# EAGLE design main_board (EAGLE 7.2.0)
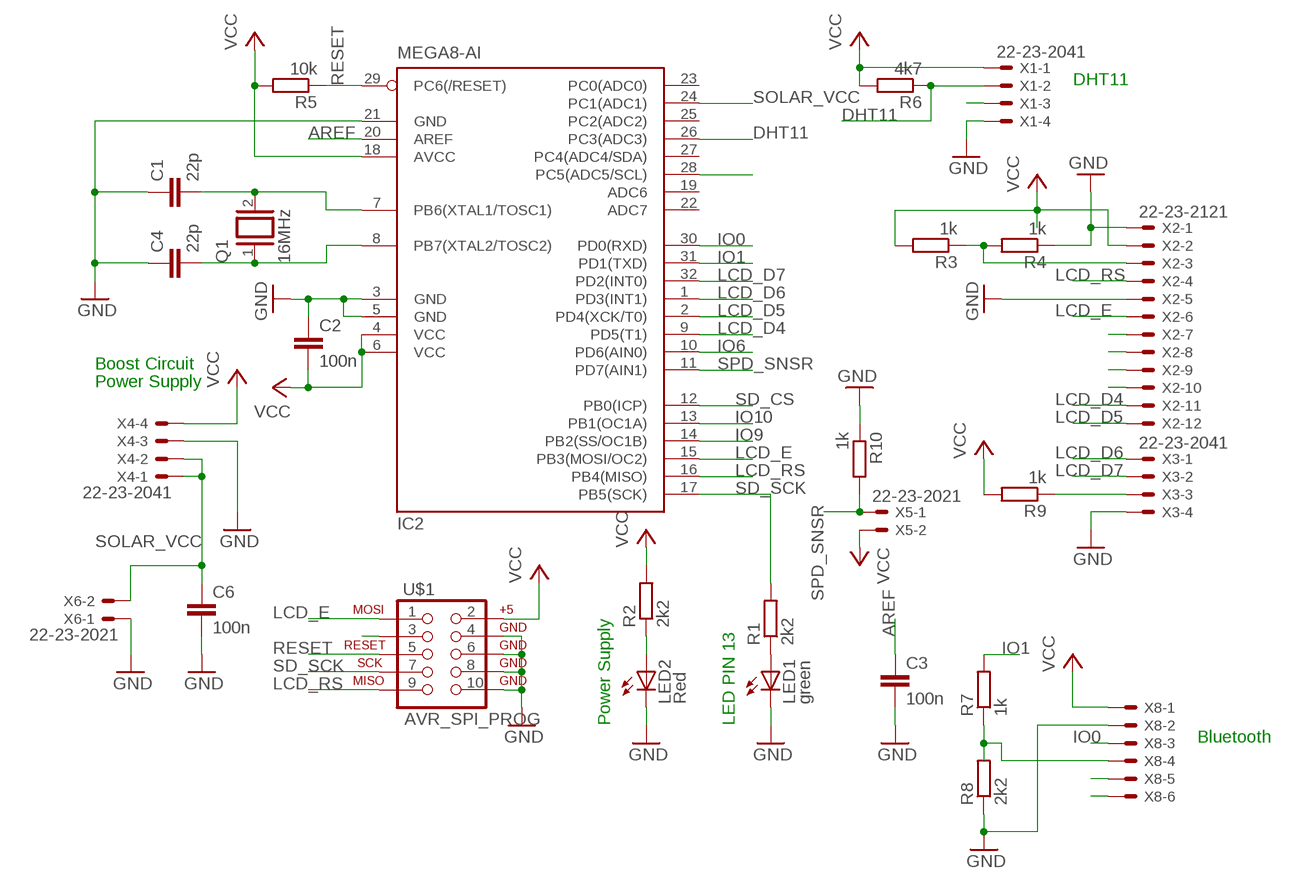
[diagram p0: schematic, sheet 1]

## Parts
C1  22p  C2,5-3  [C2.5-3]
C2  100n  C5/3  [C5B3]
C3  100n  C5/3  [C5B3]
C4  22p  C2,5-3  [C2.5-3]
C6  100n  C7.5/6  [C7.5B6]
IC2  MEGA8-AI  [TQFP32-08]
LED1  green  LED3MM  [LED3MM]
LED2  Red  LED3MM  [LED3MM]
Q1  16MHz  XTAL/S  [QS]
R1  2k2  R-EU_0204/2V  [0204V]
R2  2k2  R-EU_0204/2V  [0204V]
R3  1k  R-EU_0204/2V  [0204V]
R4  1k  R-EU_0204/2V  [0204V]
R5  10k  R-EU_0204/2V  [0204V]
R6  4k7  R-EU_0204/2V  [0204V]
R7  1k  R-EU_0204/2V  [0204V]
R8  2k2  R-EU_0204/2V  [0204V]
R9  1k  R-EU_0204/2V  [0204V]
R10  1k  R-EU_0204/2V  [0204V]
U$1  AVR_SPI_PROG  [AVR_ICSP]
X1  22-23-2041  [22-23-2041]
X2  22-23-2121  [22-23-2121]
X3  22-23-2041  [22-23-2041]
X4  22-23-2041  [22-23-2041]
X5  22-23-2021  [22-23-2021]
X6  22-23-2021  [22-23-2021]
X8  22-23-2061  [22-23-2061]

## Nets
AREF: C3.1 IC2.20(AREF)
BMP180_SCL: IC2.28(PC5(ADC5/SCL))
DHT11: IC2.26(PC3(ADC3)) R6.1 X1.2
GND: C1.1 C2.1 C3.2 C4.1 C6.2 IC2.3(GND) IC2.5(GND) IC2.21(GND) LED1.K(C) LED2.K(C) R4.1 R8.1 R10.1 U$1.4 U$1.6 U$1.8 U$1.10 X1.4 X2.1 X2.5 X3.4 X4.3 X6.1 X8.2
IO0: IC2.30(PD0(RXD)) X8.3
IO1: IC2.31(PD1(TXD)) R7.2
IO6: IC2.10(PD6(AIN0))
IO9: IC2.14(PB2(SS/OC1B))
IO10: IC2.13(PB1(OC1A))
LCD_D4: IC2.9(PD5(T1)) X2.11
LCD_D5: IC2.2(PD4(XCK/T0)) X2.12
LCD_D6: IC2.1(PD3(INT1)) X3.1
LCD_D7: IC2.32(PD2(INT0)) X3.2
LCD_E: IC2.15(PB3(MOSI/OC2)) U$1.1 X2.6
LCD_RS: IC2.16(PB4(MISO)) U$1.9 X2.4
N$1: X1.3
N$2: C1.2 IC2.7(PB6(XTAL1/TOSC1)) Q1.2
N$3: C4.2 IC2.8(PB7(XTAL2/TOSC2)) Q1.1
N$4: LED1.A R1.1
N$5: U$1.3
N$6: LED2.A R2.1
N$7: R9.1 X3.3
N$8: R3.1 R4.2 X2.3
N$9: X2.7
N$10: R7.1 R8.2 X8.4
N$11: X8.5
N$12: X8.6
N$13: X2.8
N$14: X2.9
N$15: X2.10
RESET: IC2.29(PC6(/RESET)) R5.1 U$1.5
SD_CS: IC2.12(PB0(ICP))
SD_SCK: IC2.17(PB5(SCK)) R1.2 U$1.7
SOLAR_VCC: C6.1 IC2.24(PC1(ADC1)) X4.1 X4.2 X6.2
SPD_SNSR: IC2.11(PD7(AIN1)) R10.2 X5.1
VCC: C2.2 IC2.4(VCC) IC2.6(VCC) IC2.18(AVCC) R2.2 R3.2 R5.2 R6.2 R9.2 U$1.2 X1.1 X2.2 X4.4 X5.2 X8.1
Unconnected: IC2.19(ADC6) IC2.22(ADC7) IC2.23(PC0(ADC0)) IC2.25(PC2(ADC2)) IC2.27(PC4(ADC4/SDA))

## Notes on the sheet
- DHT11
- Boost Circuit
- Power Supply
- Power Supply | LED PIN 13
- Bluetooth

## Library data of the parts
C1-C4 C6 = capacitor-wima:C: CAPACITOR naming: grid - package width
IC2 = atmel:MEGA8: MICROCONTROLLER 8 Kbytes FLASH, 1 kbytes SRAM, 512 bytes EEPROM, USART, 6-channel 10 bit ADC, 2-channel 8 bit ADC Pin compatible with Atmega48, ATMega88, ATMega168 Source: avr.lbr; MPN: ATMEGA8-16AU; OC_FARNELL: 9171371; OC_NEWARK: 73M8863
LED1 LED2 = led:LED: LED OSRAM: - CHIPLED LG R971, LG N971, LY N971, LG Q971, LY Q971, LO R971, LY R971 LH N974, LH R974 LS Q976, LO Q976, LY Q976 LO Q996 - Hyper CHIPLED LW Q18S LB Q993, LB Q99A, LB R99A - SideLED LS A670, LO A670, LY A670, LG A670, LP A670 LB A673, LV A673, LT A673, LW A673 LH A674 LY A675 LS A676, LA A676, LO A676, LY A676, LW A676 LS A679, LY A679, LG A679 - Hyper Micro SIDELED® LS Y876, LA Y876, LO Y876, LY Y876 LT Y87S - SmartLED LW L88C, LW L88S LB L89C, LB L89S, LG L890 LS L89K, LO L89K, LY L89K LS L896, LA L896, LO L896, LY L896 - TOPLED LS T670, LO T670, LY T670, LG T670, LP T670 LSG T670, LSP T670, LSY T670, LOP T670, LYG T670 LG T671, LOG T671, LSG T671 LB T673, LV T673, LT T673, LW T673 LH T674 LS T676, LA T676, LO T676, LY T676, LB T676, LH T676, LSB T676, LW T676 LB T67C, LV T67C, LT T67C, LS T67K, LO T67K, LY T67K, LW E67C LS E67B, LA E67B, LO E67B, LY E67B, LB E67C, LV E67C, LT E67C LW T67C LS T679, LY T679, LG T679 LS T770, LO T770, LY T770, LG T770, LP T770 LB T773, LV T773, LT T773, LW T773 LH T774 LS E675, LA E675, LY E675, LS T675 LS T776, LA T776, LO T776, LY T776, LB T776 LHGB T686 LT T68C, LB T68C - Hyper Mini TOPLED® LB M676 - Mini TOPLED Santana® LG M470 LS M47K, LO M47K, LY M47K Source: http://www.osram.convergy.de LUXEON: - LUMILED® LXK2-PW12-R00, LXK2-PW12-S00, LXK2-PW14-U00, LXK2-PW14-V00 LXK2-PM12-R00, LXK2-PM12-S00, LXK2-PM14-U00 LXK2-PE12-Q00, LXK2-PE12-R00, LXK2-PE12-S00, LXK2-PE14-T00, LXK2-PE14-U00 LXK2-PB12-K00, LXK2-PB12-L00, LXK2-PB12-M00, LXK2-PB14-N00, LXK2-PB14-P00, LXK2-PB14-Q00 LXK2-PR12-L00, LXK2-PR12-M00, LXK2-PR14-Q00, LXK2-PR14-R00 LXK2-PD12-Q00, LXK2-PD12-R00, LXK2-PD12-S00 LXK2-PH12-R00, LXK2-PH12-S00 LXK2-PL12-P00, LXK2-PL12-Q00, LXK2-PL12-R00 Source: www.luxeon.com KINGBRIGHT: KA-3528ASYC Source: www.kingbright.com
Q1 = special:XTAL/S: CRYSTAL
R1-R10 = resistor:R-EU_: RESISTOR, European symbol
U$1 = SparkFun-Connectors:AVR_SPI_PROG: AVR 10-pin ICSP Header This is the standard AVR In Circuit Serial Programming header. Minimal, but includes pin one indicator. Works with standard Olimex programmers. Also look for the 6-pin reduced version. Spark Fun Electronics SKU: PRT-00778
X1 X3 X4 = con-molex:22-23-2041: .100" (2.54mm) Center Header - 4 Pin; MF: MOLEX; MPN: 22-23-2041; OC_FARNELL: 1462920; OC_NEWARK: 38C0355
X2 = con-molex:22-23-2121: .100" (2.54mm) Center Header - 12 Pin; MF: MOLEX; MPN: 22-23-2121; OC_FARNELL: 1462935; OC_NEWARK: 56H0456
X5 X6 = con-molex:22-23-2021: .100" (2.54mm) Center Header - 2 Pin; MF: MOLEX; MPN: 22-23-2021; OC_FARNELL: 1462926; OC_NEWARK: 25C3832
X8 = con-molex:22-23-2061: .100" (2.54mm) Center Header - 6 Pin; MF: MOLEX; MPN: 22-23-2061; OC_FARNELL: 1462922; OC_NEWARK: 27C1933

## Board
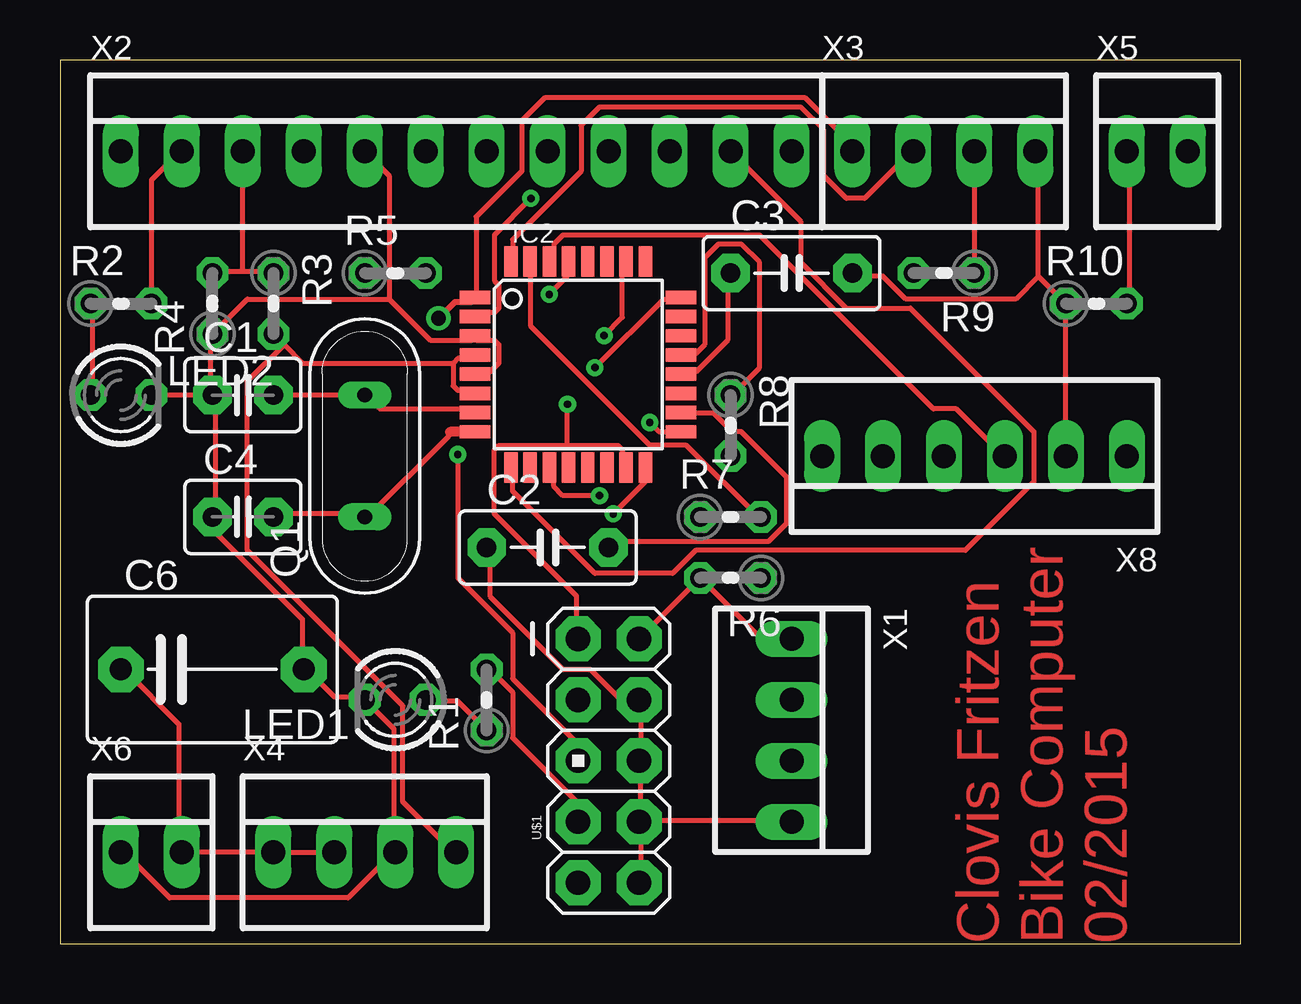
[diagram p1: board, top side]
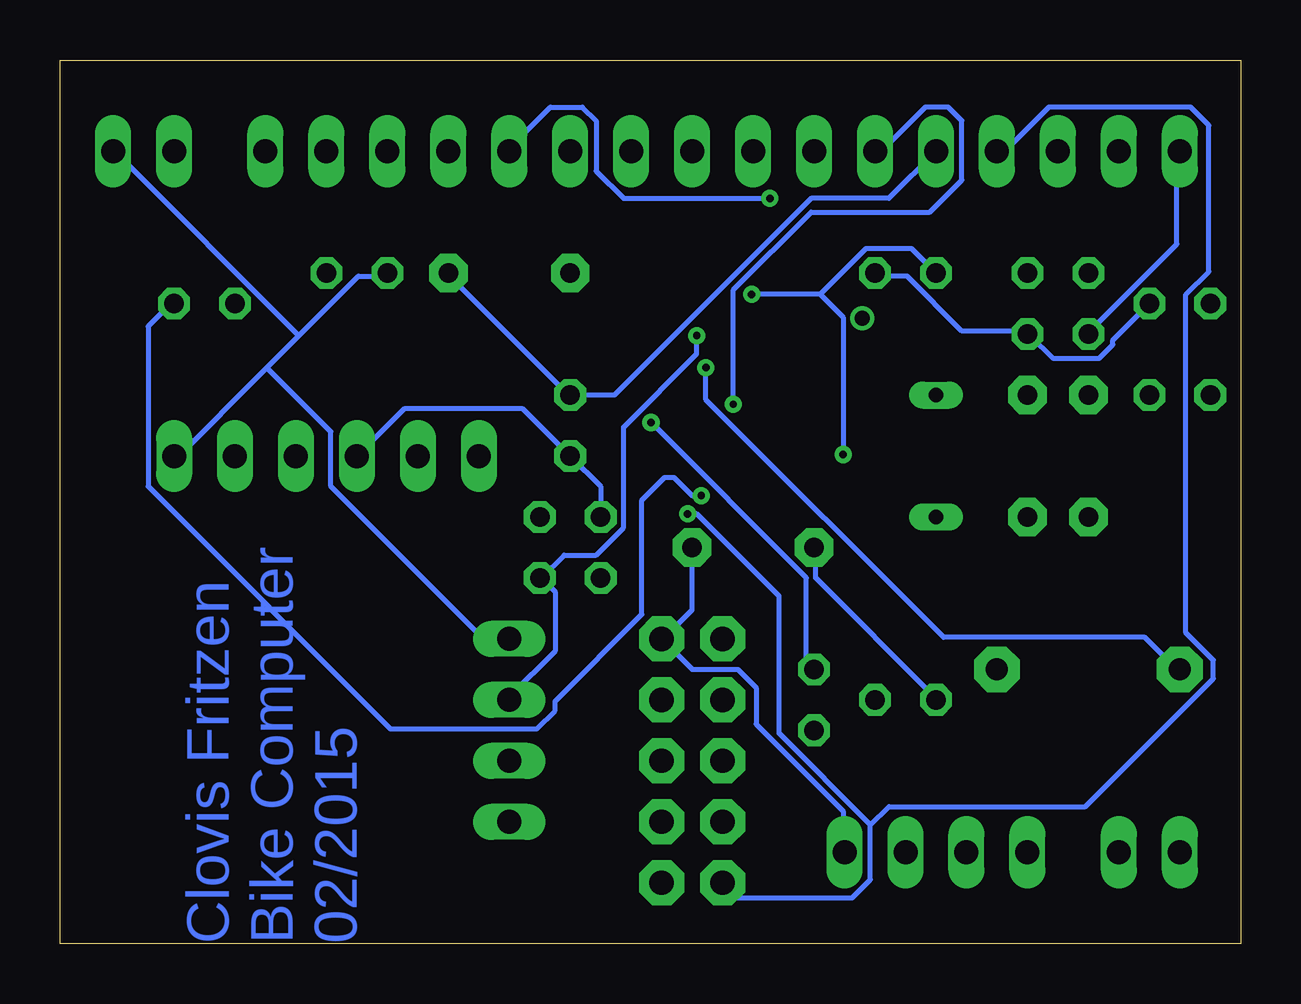
[diagram p2: board, bottom side, seen from below]

Size 49.2 x 36.82 mm. Coordinates in mm from the lower left corner, seen from the top.
Outline: 0,0 49.2,0 49.2,36.82 0,36.82 0,0
Copper layers (1*16): Top 0.035mm / dielectric 1.5mm / Bottom 0.035mm
Design rules "default *": minimum track width 8mil, minimum drill 12mil, track to track 7mil, track to pad 7mil, pad to pad 7mil, via to via 7mil, smd to smd 7mil, copper to edge 20mil, drill to drill 8mil, minimum pad ring 10mil, minimum via ring 8mil, stop-mask expansion 4mil, vias tented up to drill 0mil, thermal gap 10mil

### Footprints (pad centres in the part's own frame; a part is rotated, then mirrored left to right if it is on the bottom)
C2.5-3 = drill 0.813 pad 1.6 octagon: 1 -1.27,0; 2 1.27,0
C5B3 = drill 0.813 pad 1.6 octagon: 1 -2.54,0; 2 2.54,0
C7.5B6 = drill 0.914 pad 1.905 octagon: 1 -3.81,0; 2 3.81,0
TQFP32-08 = smd 1.27 x 0.559: 1 -4.293,2.8; 2 -4.293,2; 3 -4.293,1.2; 4 -4.293,0.4; 5 -4.293,-0.4; 6 -4.293,-1.2; 7 -4.293,-2; 8 -4.293,-2.8; 17 4.293,-2.8; 18 4.293,-2; 19 4.293,-1.2; 20 4.293,-0.4; 21 4.293,0.4; 22 4.293,1.2; 23 4.293,2; 24 4.293,2.8 | smd 0.559 x 1.27: 9 -2.8,-4.293; 10 -2,-4.293; 11 -1.2,-4.293; 12 -0.4,-4.293; 13 0.4,-4.293; 14 1.2,-4.293; 15 2,-4.293; 16 2.8,-4.293; 25 2.8,4.293; 26 2,4.293; 27 1.2,4.293; 28 0.4,4.293; 29 -0.4,4.293; 30 -1.2,4.293; 31 -2,4.293; 32 -2.8,4.293
LED3MM = drill 0.813 octagon: A -1.27,0; K 1.27,0
QS = drill 0.61 long: 1 -2.54,0; 2 2.54,0
0204V = drill 0.813 octagon: 1 -1.27,0; 2 1.27,0
AVR_ICSP = drill 1.016 pad 1.88 octagon: 1 -1.27,5.08; 2 1.27,5.08; 3 -1.27,2.54; 4 1.27,2.54; 5 -1.27,0; 6 1.27,0; 7 -1.27,-2.54; 8 1.27,-2.54; 9 -1.27,-5.08; 10 1.27,-5.08
22-23-2041 = drill 1 long: 1 -3.81,0; 2 -1.27,0; 3 1.27,0; 4 3.81,0
22-23-2121 = drill 1 long: 1 -13.97,0; 2 -11.43,0; 3 -8.89,0; 4 -6.35,0; 5 -3.81,0; 6 -1.27,0; 7 1.27,0; 8 3.81,0; 9 6.35,0; 10 8.89,0; 11 11.43,0; 12 13.97,0
22-23-2021 = drill 1 long: 1 -1.27,0; 2 1.27,0
22-23-2061 = drill 1 long: 1 -6.35,0; 2 -3.81,0; 3 -1.27,0; 4 1.27,0; 5 3.81,0; 6 6.35,0

### Placement (x,y rotation side)
C1  7.62,22.86 0 top
C2  20.32,16.51 0 top
C3  30.48,27.94 0 top
C4  7.62,17.78 0 top
C6  6.35,11.43 0 top
IC2  21.59,24.13 0 top
LED1  13.97,10.16 180 top
LED2  2.54,22.86 0 top
Q1  12.7,20.32 90 top
R1  17.78,10.16 90 top
R2  2.54,26.67 0 top
R3  8.89,26.67 270 top
R4  6.35,26.67 90 top
R5  13.97,27.94 0 top
R6  27.94,15.24 180 top
R7  27.94,17.78 0 top
R8  27.94,21.59 270 top
R9  36.83,27.94 180 top
R10  43.18,26.67 0 top
U$1  22.86,7.62 0 top
X1  30.48,8.89 270 top
X2  16.51,33.02 0 top
X3  36.83,33.02 0 top
X4  12.7,3.81 0 top
X5  45.72,33.02 0 top
X6  3.81,3.81 0 top
X8  38.1,20.32 180 top

### Tracks (layer width: path | path; a pad name or v marks a point on that pad's centre or on a via)
AREF
  Top 0.203: IC2.20 25.91,23.81 26.48,23.81 27.81,25.15 27.81,27.81 C3.1
DHT11  (via drill 0.3)
  Top 0.203: v22.67,25.34 23.43,26.1 23.43,28.38 IC2.26
  Bottom 0.203: v22.67,25.34 22.67,24.57 25.72,21.53 25.72,17.34 26.86,16.19 28.19,16.19 29.15,15.24 | 29.15,15.24 28.57,14.67 28.57,12.19 30.48,10.29 X1.2 | 29.15,15.24 R6.1
GND
  Top 0.203: 24.19,7.62 24.19,10.1 U$1.4 24,10.29 23.24,10.29 22.1,11.43 20.95,11.43 17.91,14.48 17.91,16.38 C2.1 | 24.19,5.14 30.48,5.14 X1.4 | U$1.10 24.19,2.67 24.19,4.95 U$1.8 24.19,5.14 | 24.19,5.14 24.19,7.62 | 24.19,7.62 U$1.6 | 13.91,3.81 12,1.91 4.57,1.91 2.67,3.81 X6.1 | 13.91,3.81 13.91,8.95 LED1.K 12.57,10.29 11.43,10.29 10.29,11.43 C6.2 10.1,11.43 10.1,13.53 6.48,17.14 6.48,17.72 C4.1 6.48,17.91 6.48,22.86 C1.1 6.29,22.86 | 13.91,3.81 X4.3 | IC2.21 25.91,24.57 26.48,24.57 26.86,24.96 26.86,28.57 27.43,29.15 28.38,29.15 29.15,28.38 29.15,24 28,22.86 R8.1 | X8.2 R10.1 40.77,27.81 | 40.77,27.81 40.77,32.96 X3.4 | 40.77,27.81 39.81,26.86 35.24,26.86 34.29,27.81 33.15,27.81 C3.2 | IC2.5 17.34,23.81 17.91,23.81 18.29,24.19 18.29,24.96 18.1,25.15 17.34,25.15 IC2.3 | 17.14,25.15 15.43,25.15 13.72,26.86 | 13.72,26.86 13.72,32 X2.5 | 6.29,22.86 LED2.K | 6.29,22.86 6.29,25.34 R4.1 7.81,26.86 13.72,26.86
  Top 0.254: 17.14,25.15 IC2.3
  Bottom 0.203: C2.1 17.72,16.38 17.72,15.24 12.76,10.29 LED1.K | C3.2 32.96,27.81 28,22.86 R8.1 26.1,22.86 17.91,31.05 14.67,31.05 X2.5 | X2.1 2.67,32.96 2.67,29.15 6.29,25.53 R4.1
IO0
  Top 0.203: IC2.30 20.57,28.57 20.57,29.15 20.95,29.53 29.15,29.53 36.39,22.29 37.34,22.29 39.24,20.38 X8.3
IO1
  Top 0.203: IC2.31 19.62,28.38 19.62,25.72 24.57,20.77 26.1,20.77 29.15,17.72 R7.2
LCD_D4
  Top 0.203: X2.11 30.86,30.1 30.86,28.38 32.77,26.48 35.43,26.48 40.58,21.34 40.58,19.24 37.72,16.38 26.48,16.38 25.53,15.43 22.29,15.43 18.86,18.86 18.86,19.81 IC2.9
LCD_D5  (via drill 0.3)
  Top 0.203: v19.62,31.05 18.1,29.53 18.1,27.62 18.29,27.43 18.29,26.48 18.1,26.29 17.34,26.29 IC2.2
  Bottom 0.203: v19.62,31.05 25.72,31.05 26.86,32.19 26.86,34.29 27.43,34.86 28.77,34.86 30.48,33.15 X2.12
LCD_D6  (via drill 0.61)
  Top 0.203: IC2.1 17.34,27.05 17.34,30.29 19.24,32.19 19.24,34.29 20.19,35.24 31.05,35.24 33.15,33.15 X3.1
  Top 0.254: v15.77,26.06 16.46,26.75 17.14,26.75 IC2.1
LCD_D7
  Top 0.203: IC2.32 18.86,28.57 18.86,29.34 21.72,32.19 21.72,34.1 22.48,34.86 30.86,34.86 31.81,33.91 31.81,32 32.77,31.05 33.53,31.05 35.43,32.96 X3.2
  Top 0.254: 18.75,28.57 IC2.32
LCD_E  (via drill 0.3)
  Top 0.203: 21.14,20.77 18.29,20.77 18.1,20.57 18.1,17.91 21.53,14.48 21.53,12.76 U$1.1 | 21.14,20.77 23.24,20.77 23.43,20.57 23.43,20 IC2.15 | 21.14,20.77 v21.14,22.48
  Bottom 0.203: v21.14,22.48 21.14,27.24 17.91,30.48 12.95,30.48 11.62,31.81 11.62,34.29 12.19,34.86 13.14,34.86 14.86,33.15 15.24,33.15 X2.6
LCD_RS  (via drill 0.3)
  Top 0.203: v23.05,17.91 24.38,19.24 24.38,19.81 IC2.16
  Bottom 0.203: v23.05,17.91 22.67,17.91 19.24,14.48 19.24,8.76 15.43,4.95 | 15.43,4.95 15.43,2.67 16.19,1.91 20.95,1.91 U$1.9 | 15.43,4.95 14.67,5.71 6.48,5.71 1.14,11.05 1.14,11.81 2.29,12.95 2.29,27.05 1.33,28 1.33,34.1 2.1,34.86 8,34.86 9.72,33.15 10.1,33.15 X2.4
N$2
  Top 0.203: IC2.7 17.14,22.29 13.34,22.29 12.76,22.86 Q1.2 C1.2
N$3
  Top 0.203: 16.25,21.33 16.19,21.14 12.76,17.72 Q1.1 12.57,17.91 8.95,17.91 C4.2
  Top 0.406: IC2.8 16.25,21.33
N$4
  Top 0.203: R1.1 16.57,10.1 15.24,10.1 LED1.A
N$6
  Top 0.203: LED2.A 1.33,22.86 1.33,26.67 R2.1
N$7
  Top 0.203: X3.3 R9.1
N$8
  Top 0.203: 7.62,28 8.76,28 R3.1 | 7.62,28 6.48,28 R4.2 | 7.62,28 X2.3
N$10
  Bottom 0.203: R7.1 26.67,19.05 R8.2 29.91,22.29 34.86,22.29 X8.4
RESET  (via drill 0.3)
  Top 0.203: v20.38,27.05 21.14,27.81 21.14,28.38 IC2.29 | v16.57,20.38 16.57,15.24 18.86,12.95 18.86,11.05 21.53,8.38 21.53,7.62 U$1.5
  Bottom 0.203: 17.53,27.05 v20.38,27.05 | 17.53,27.05 15.62,28.96 13.72,28.96 R5.1 | v16.57,20.38 16.57,26.1 17.53,27.05
SD_SCK  (via drill 0.3)
  Top 0.203: v24.57,21.72 24.96,21.34 25.72,21.34 IC2.17 | U$1.7 21.53,5.14 21.53,5.91 18.86,8.57 18.86,10.48 17.91,11.43 R1.2
  Bottom 0.203: v24.57,21.72 18.1,15.24 18.1,11.62 17.91,11.43 R1.2
SOLAR_VCC  (via drill 0.3)
  Top 0.203: X4.2 X4.1 X6.2 4.95,3.81 4.95,9.14 2.67,11.43 C6.1 | v22.29,24 25.15,26.86 25.72,26.86 IC2.24
  Bottom 0.203: v22.29,24 22.29,22.67 12.38,12.76 4,12.76 2.67,11.43 C6.1
SPD_SNSR  (via drill 0.3)
  Top 0.203: v22.48,18.67 20.95,18.67 20.57,19.05 20.57,19.81 IC2.11 | X5.1 44.58,32.96 44.58,26.67 R10.2
  Bottom 0.203: v22.48,18.67 22.86,18.67 23.62,19.43 24,19.43 24.96,18.48 24.96,13.72 28.57,10.1 28.57,9.72 29.34,8.95 35.43,8.95 45.53,19.05 45.53,25.72 44.58,26.67 R10.2
VCC
  Top 0.203: R2.2 3.81,31.81 4.95,32.96 X2.2 | 16.38,24.19 16.38,23.24 16.57,23.05 17.14,23.05 IC2.6 | 16.38,24.19 16.57,24.38 17.14,24.38 IC2.4 | 16.38,24.19 10.1,24.19 9.34,24.96 | 9.34,24.96 R3.2 8.95,25.34 | IC2.18 25.91,22.1 27.24,22.1 28,21.34 28.38,21.34 30.29,19.43 30.29,17.53 29.53,16.76 23.05,16.76 22.86,16.57 C2.2 | U$1.2 R6.2 29.15,12.76 30.48,12.76 X1.1 | 9.34,24.96 7.81,23.43 7.81,16.38 14.29,9.91 14.29,5.91 16.38,3.81 X4.4
  Top 0.254: 15.32,27.89 R5.2
  Bottom 0.203: 40.58,24 44.39,20.19 X8.1 | 40.58,24 39.24,25.34 | 39.24,25.34 36.77,27.81 35.62,27.81 R9.2 | 39.24,25.34 46.86,32.96 X5.2 | R5.2 15.24,27.81 13.91,27.81 11.62,25.53 8.95,25.53 R3.2 8.76,25.34 7.81,24.38 5.91,24.38 5.33,24.96 5.33,25.15 R2.2 | X4.4 16.57,3.81 16.57,5.52 20.19,9.14 20.19,10.67 20.95,11.43 22.86,11.43 U$1.2 24,12.76 22.86,13.91 C2.2 | 40.58,24 37.91,21.34 37.91,19.05 31.62,12.76 30.48,12.76 X1.1

### Text on the board
Top: Clovis Fritzen / Bike Computer / 02/2015
Bottom: Clovis Fritzen / Bike Computer / 02/2015